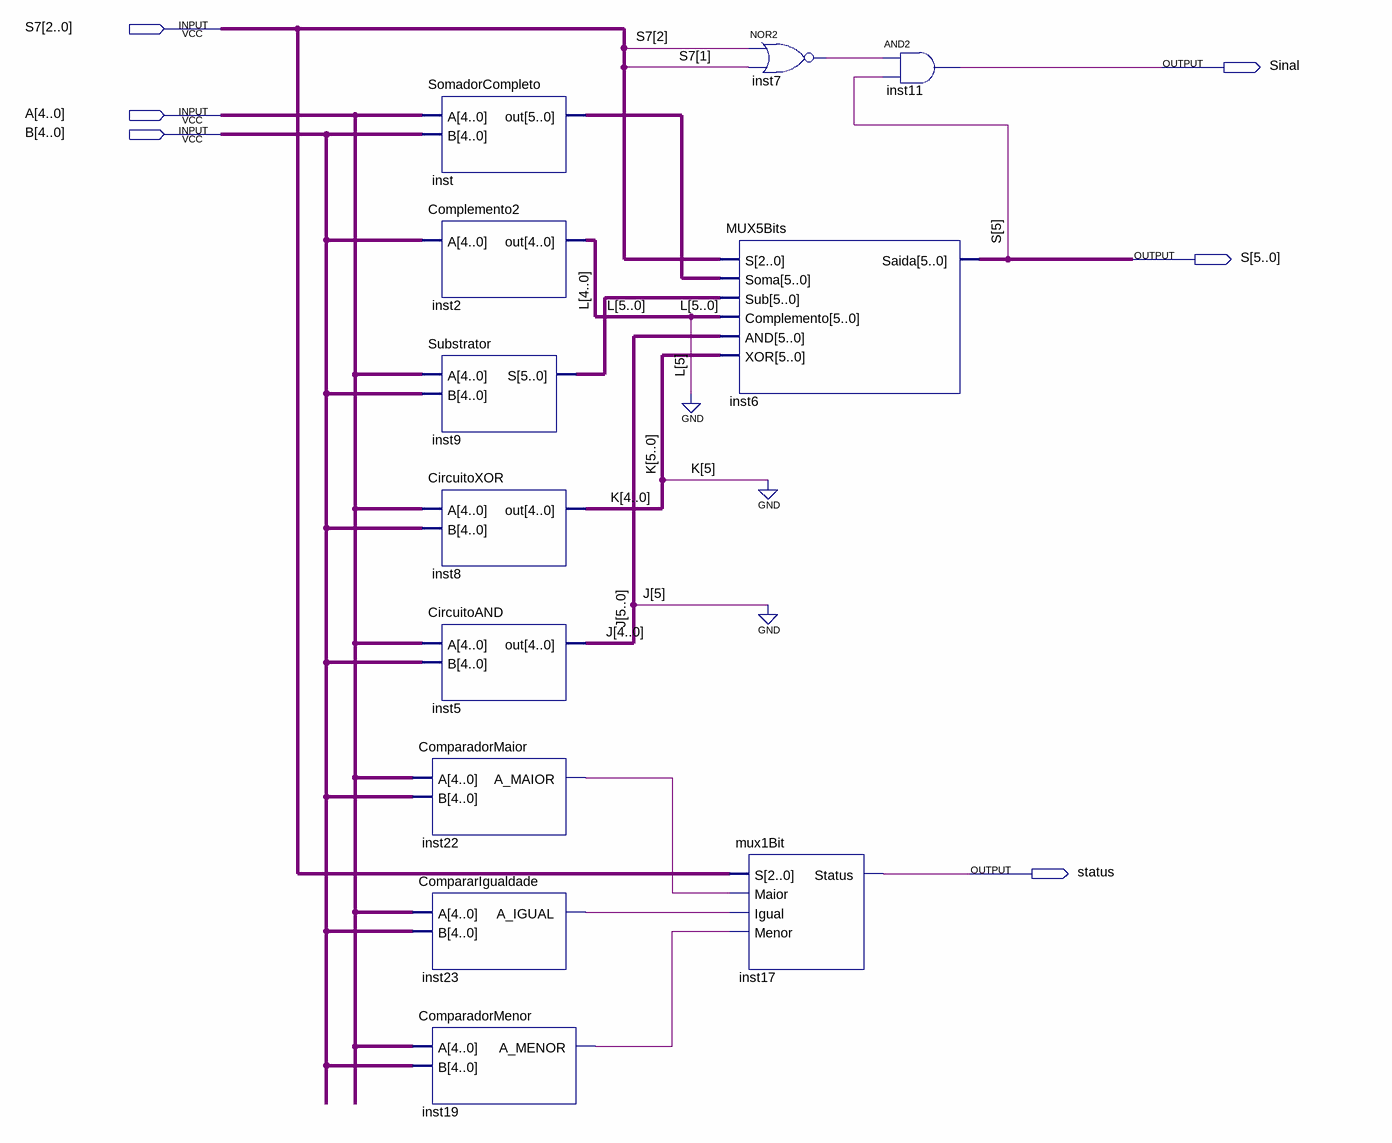
[diagram p0: schematic sheet]
// Quartus schematic ULA.bdf as structural Verilog: 12 symbols, 6 pins
module ULA (
  input  [2:0] S7,
  input  [4:0] A,
  input  [4:0] B,
  output Sinal,
  output [5:0] S,
  output status
);

  wire inst7_out, inst19_a_menor, inst22_a_maior, inst23_a_igual;
  wire [4:0] J, K, L;
  wire [5:0] inst9_s, inst_out;

  SomadorCompleto inst (.A(A), .B(B), .out(inst_out));
  Complemento2 inst2 (.A(B), .out(L));
  Substrator inst9 (.A(A), .B(B), .S(inst9_s));
  CircuitoXOR inst8 (.A(A), .B(B), .out(K));
  CircuitoAND inst5 (.A(A), .B(B), .out(J));
  ComparadorMaior inst22 (.A(A), .B(B), .A_MAIOR(inst22_a_maior));
  CompararIgualdade inst23 (.A(A), .B(B), .A_IGUAL(inst23_a_igual));
  ComparadorMenor inst19 (.A(A), .B(B), .A_MENOR(inst19_a_menor));
  nor inst7 (inst7_out, S7[2], S7[1]);
  MUX5Bits inst6 (
    .S(S7), .Soma(inst_out), .Sub(inst9_s), .Complemento({1'b0, L}), .AND({1'b0, J}), .XOR({1'b0, K}),
    .Saida(S));
  mux1Bit inst17 (.S(S7), .Maior(inst22_a_maior), .Igual(inst23_a_igual), .Menor(inst19_a_menor), .Status(status));
  and inst11 (Sinal, inst7_out, S[5]);
endmodule
